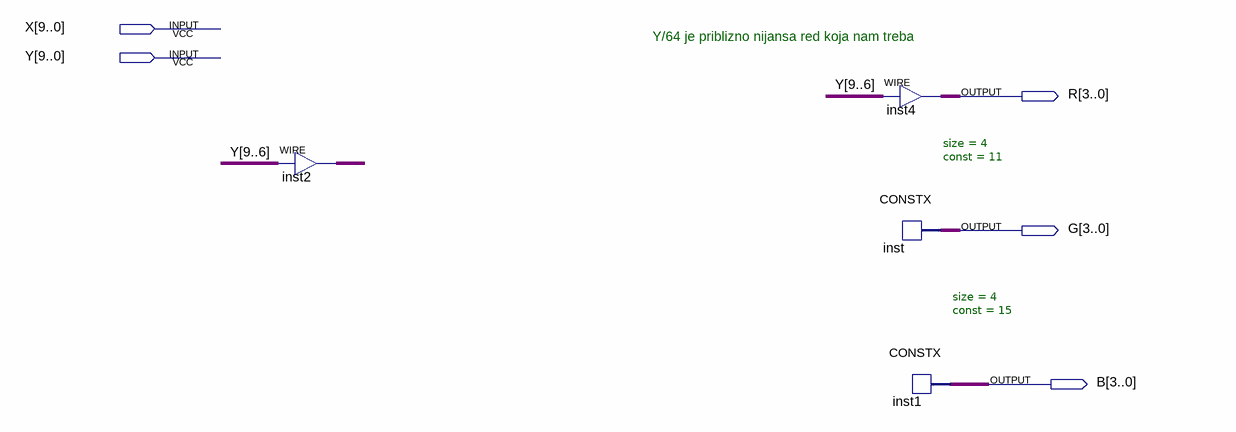
[diagram p0: schematic sheet]
// Quartus schematic Background.bdf as structural Verilog: 4 symbols, 5 pins
module Background (
  input  [9:0] X,
  input  [9:0] Y,
  output [3:0] R,
  output [3:0] G,
  output [3:0] B
);

  wire [3:0] inst2_out;

  assign inst2_out = Y[9:6];  // WIRE inst2
  assign R = Y[9:6];  // WIRE inst4
  CONSTX #(.size(4), .\const (11)) inst (.data(G));
  CONSTX #(.size(4), .\const (15)) inst1 (.data(B));

  // Notes on the sheet:
  //   Y/64 je priblizno nijansa red koja nam treba
endmodule
